# Altium schematic sheet NQN-SCHEMATIC.SchDoc
size A3
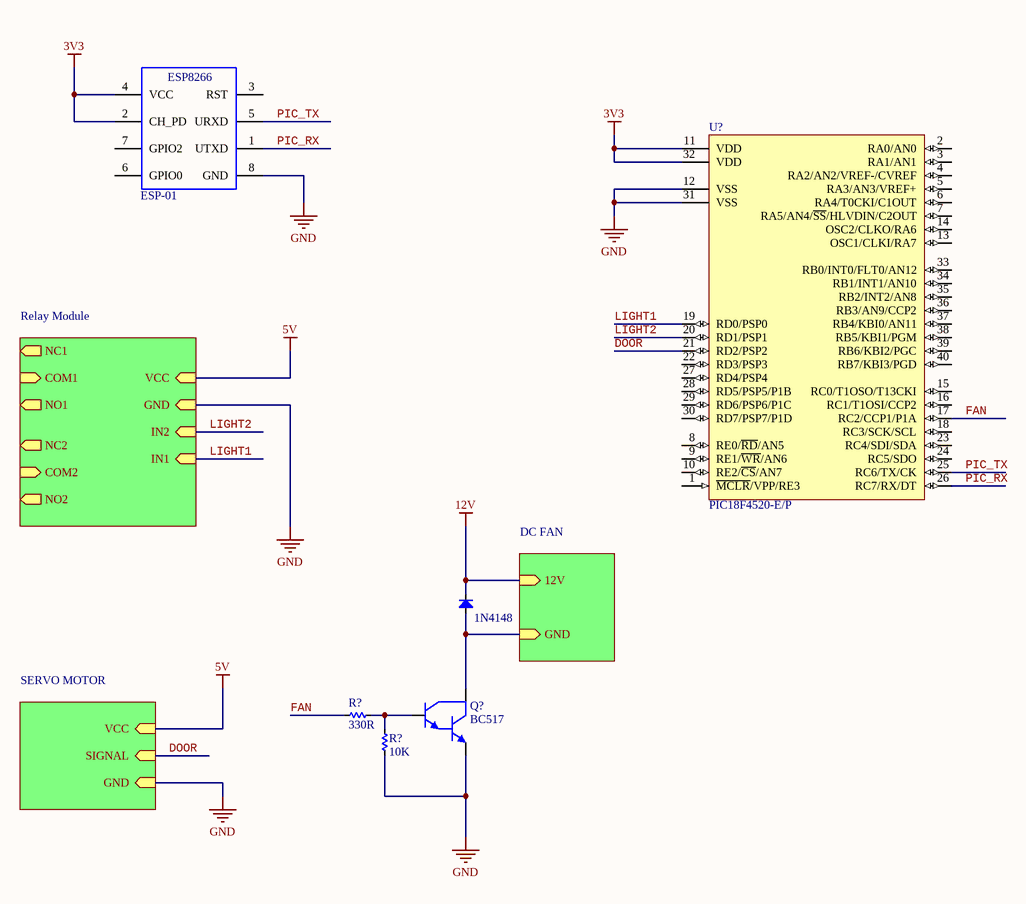
[diagram p0: NQN-SCHEMATIC.SchDoc]

## Parts
(Parts that share a designator on the sheet are numbered #1, #2 ... from top to bottom, then left to right.)
1N4148  Diode  [DIO-1A]  (value not drawn)
Q?  BC517  [TO220-123]
R?#1  330R  [RES-1/2W]
R?#2  10K  [RES-1/2W]
U?#1  ESP-01  [ESP8266]
U?#2  PIC18F4520-E/P  [PDIP600-P40]

## Sub-sheets
DC FAN = File Name: GND (in), 12V (in)
Relay Module = File Name: COM1 (in), COM2 (in), NC1 (out), NC2 (out), NO1 (out), NO2 (out), VCC (in), GND (in), IN2 (in), IN1 (in)
SERVO MOTOR = File Name: VCC (in), SIGNAL (in), GND (in)

## Nets
3V3: U?#1.2(CH_PD) U?#1.4(VCC) U?#2.11(VDD) U?#2.32(VDD)
5V: sheet Relay Module/VCC, sheet SERVO MOTOR/VCC
12V: 1N4148.2(K) ; sheet DC FAN/12V
GND: Q?.3(E) R?#2.2 U?#1.8(GND) U?#2.12(VSS) U?#2.31(VSS) ; sheet Relay Module/GND, sheet SERVO MOTOR/GND
DOOR: U?#2.21(RD2/PSP2) ; sheet SERVO MOTOR/SIGNAL
FAN: R?#1.2 U?#2.17(RC2/CCP1/P1A)
LIGHT1: U?#2.19(RD0/PSP0) ; sheet Relay Module/IN1
LIGHT2: U?#2.20(RD1/PSP1) ; sheet Relay Module/IN2
PIC_RX: U?#1.1(UTXD) U?#2.26(RC7/RX/DT)
PIC_TX: U?#1.5(URXD) U?#2.25(RC6/TX/CK)
Net1N4148_1: 1N4148.1(A) Q?.2(C) ; sheet DC FAN/GND
NetQ?_1: Q?.1(B) R?#1.1 R?#2.1

Not connected (* = marked no-connect by the designer): U?#1 3(RST) 6(GPIO0) 7(GPIO2); U?#2 1(~{MCLR}/VPP/RE3) 2(RA0/AN0) 3(RA1/AN1) 4(RA2/AN2/VREF-/CVREF) 5(RA3/AN3/VREF+) 6(RA4/T0CKI/C1OUT) 7(RA5/AN4/~{SS}/HLVDIN/C2OUT) 8(RE0/~{RD}/AN5) 9(RE1/~{WR}/AN6) 10(RE2/~{CS}/AN7) 13(OSC1/CLKI/RA7) 14(OSC2/CLKO/RA6) 15(RC0/T1OSO/T13CKI) 16(RC1/T1OSI/CCP2) 18(RC3/SCK/SCL) 22(RD3/PSP3) 23(RC4/SDI/SDA) 24(RC5/SDO) 27(RD4/PSP4) 28(RD5/PSP5/P1B) 29(RD6/PSP6/P1C) 30(RD7/PSP7/P1D) 33(RB0/INT0/FLT0/AN12) 34(RB1/INT1/AN10) 35(RB2/INT2/AN8) 36(RB3/AN9/CCP2) 37(RB4/KBI0/AN11) 38(RB5/KBI1/PGM) 39(RB6/KBI2/PGC) 40(RB7/KBI3/PGD)

## Notes on the sheet
- (in symbol ESP8266-01) ESP8266

## Library data of the parts
1N4148 = Diode: Default Diode; Code - JEDEC: DO-214-AB; Value: 1N5007; Published: 8-Jun-2000; Revision: July-2002: Re-released for DXP Platform.; Publisher: Altium Limited
Q? = TIP122: Darlington Silicon Power NPN Transistor, 8 Amp, 100 Volts and 65 Watts
R?#1 R?#2 = Res: Manufacturer: Generic Components; Class: Passive; SubClass: R; Published: 08/06/2000; Publisher: Altium Hobart Technology Centre
U?#1 = ESP8266-01: ESP-12 Wi-Fi Module
U?#2 = CMP-0116-00035-1: Enhanced Flash Microcontroller with 10-Bit A/D and nanoWatt Technology, 32K Flash, 40-Pin PDIP, Extended Temperature Range; DatasheetVersion: revE, Oct-2008; PackageVersion: revBB, Aug-2009; PackageDescription: 40-Lead Plastic Dual In-Line (P) - 600 mil Body [PDIP]; PackageReference: PDIP600-P40